# Altium schematic sheet main.SchDoc: Main
size A4; Date: 2014-12-21; Author: Artur Scholz; DocumentNumber: LibreCube LC23-01a
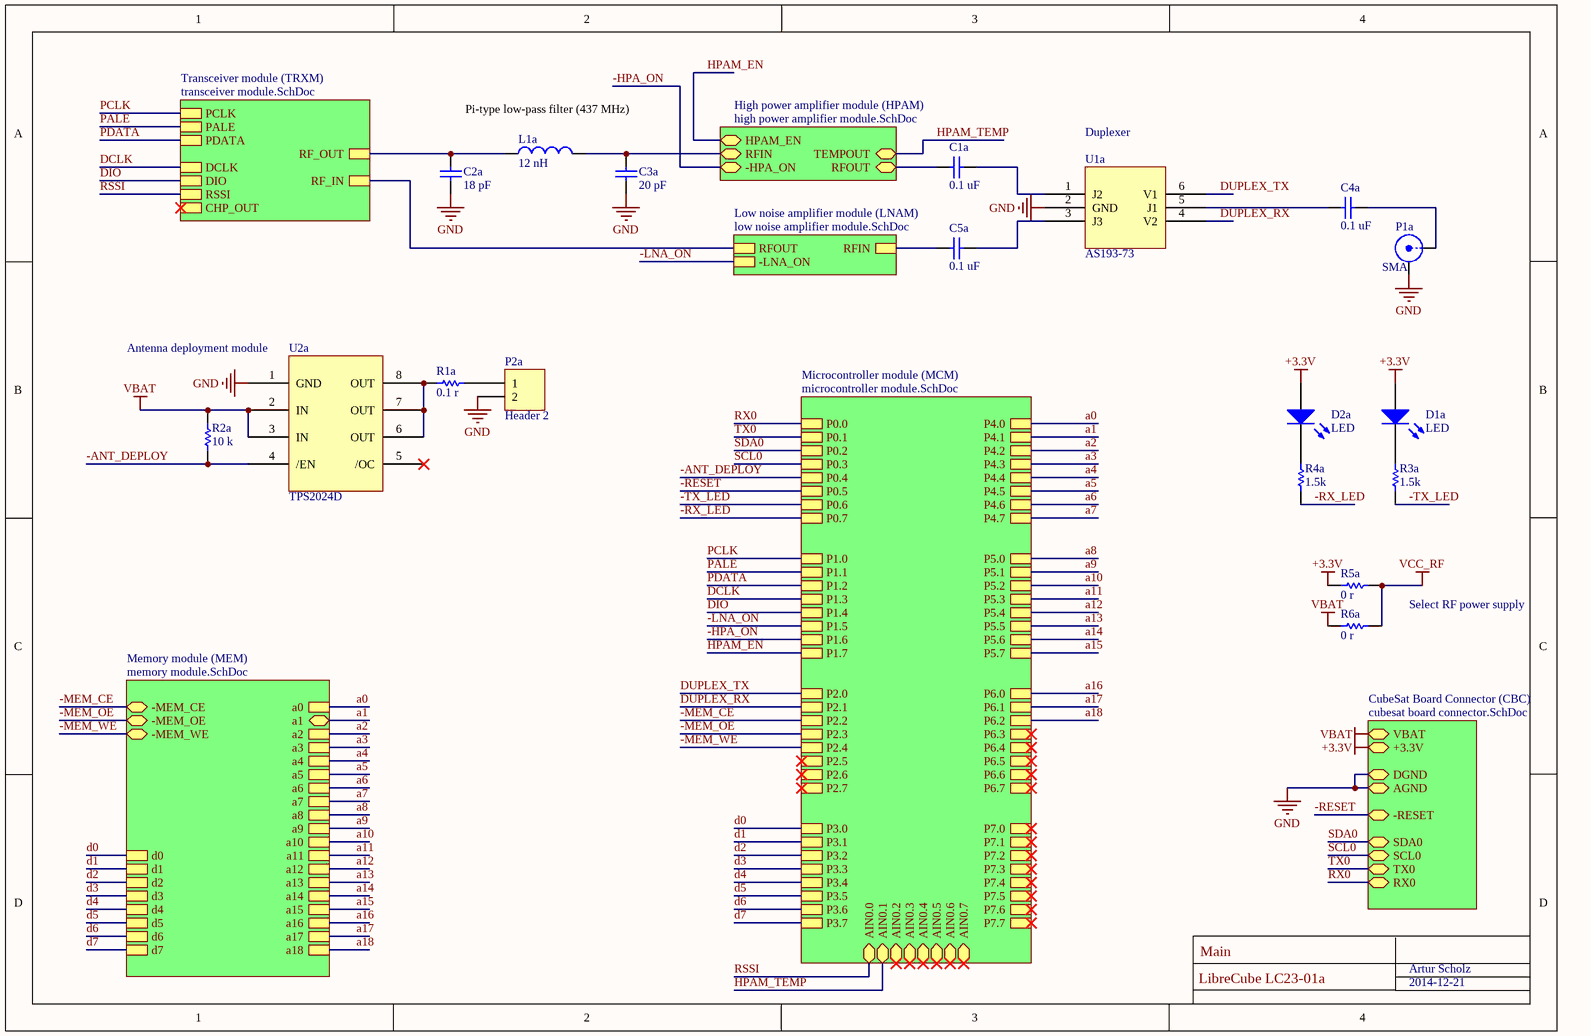
[diagram p0: main.SchDoc]

## Parts
C1a  0.1 uF  [0603]
C2a  18 pF  [0603]
C3a  20 pF  [0603]
C4a  0.1 uF  [0603]
C5a  0.1 uF  [0603]
D1a  LED  [0603]
D2a  LED  [0603]
L1a  12 nH  [0603]
P1a  SMA  [SMA]
P2a  Header 2  [HDR1X2]
R1a  0.1 r  [2512]
R2a  10 k  [0603]
R3a  1.5k  [0603]
R4a  1.5k  [0603]
R5a  0 r  [0603]
R6a  0 r  [0603]
U1a  AS193-73  [SOT-6]
U2a  TPS2024D  [SO-8]

## Sub-sheets
CubeSat Board Connector (CBC) = cubesat board connector.SchDoc: SDA0, SCL0, -RESET, +3.3V, VBAT, AGND, DGND, TX0, RX0
High power amplifier module (HPAM) = high power amplifier module.SchDoc: RFOUT, RFIN, HPAM_EN, TEMPOUT, -HPA_ON
Low noise amplifier module (LNAM) = low noise amplifier module.SchDoc: RFOUT, RFIN, -LNA_ON
Memory module (MEM) = memory module.SchDoc: a13, a11, a9, a8, a18, a17, a15, a7, a16, a14, a12, a6, a5, a4, a0, d0, a3, a2, d3, d1, d2, d7, d4, d5, d6, a10, a1, -MEM_WE, -MEM_CE, -MEM_OE
Microcontroller module (MCM) = microcontroller module.SchDoc: P0.0, P0.1, P0.2, P0.3, P0.4, P0.5, P0.6, P0.7, P3.0, P3.1, P3.2, P3.3, P3.4, P3.5, P3.6, P3.7, P2.0, P2.1, P2.2, P2.3, P2.4, P2.5, P2.6, P2.7, P1.0, P1.1, P1.2, P1.3, P1.4, P1.5, P1.6, P1.7, P4.0, P4.1, P4.2, P4.3, P4.4, P4.5, P4.6, P4.7, P7.0, P7.1, P7.2, P7.3, P7.4, P7.5, P7.6, P7.7, P5.0, P5.1, P5.2, P5.3, P5.4, P5.5, P5.6, P5.7, P6.0, P6.1, P6.2, P6.3, P6.4, P6.5, P6.6, P6.7, AIN0.0, AIN0.1, AIN0.2, AIN0.3, AIN0.4, AIN0.5, AIN0.6, AIN0.7
Transceiver module (TRXM) = transceiver module.SchDoc: PALE, PDATA, PCLK, DCLK, DIO, RSSI, CHP_OUT, RF_IN, RF_OUT

## Nets
+3.3V: D1a.1(A) D2a.1(A) R5a.2 ; sheet CubeSat Board Connector (CBC)/+3.3V
GND: C2a.1 C3a.1 P1a.2(Y) P2a.2 U1a.2(GND) U2a.1(GND) ; sheet CubeSat Board Connector (CBC)/AGND, sheet CubeSat Board Connector (CBC)/DGND
VBAT: R2a.2 R6a.2 U2a.2(IN) U2a.3(IN) ; sheet CubeSat Board Connector (CBC)/VBAT
VCC_RF: R5a.1 R6a.1
-ANT_DEPLOY: R2a.1 U2a.4(/EN) ; sheet Microcontroller module (MCM)/P0.4
-HPA_ON: sheet High power amplifier module (HPAM)/-HPA_ON, sheet Microcontroller module (MCM)/P1.6
-LNA_ON: sheet Microcontroller module (MCM)/P1.5, sheet Low noise amplifier module (LNAM)/-LNA_ON
-MEM_CE: sheet Memory module (MEM)/-MEM_CE, sheet Microcontroller module (MCM)/P2.2
-MEM_OE: sheet Memory module (MEM)/-MEM_OE, sheet Microcontroller module (MCM)/P2.3
-MEM_WE: sheet Memory module (MEM)/-MEM_WE, sheet Microcontroller module (MCM)/P2.4
-RESET: sheet CubeSat Board Connector (CBC)/-RESET, sheet Microcontroller module (MCM)/P0.5
-RX_LED: R4a.2 ; sheet Microcontroller module (MCM)/P0.7
-TX_LED: R3a.2 ; sheet Microcontroller module (MCM)/P0.6
a0: sheet Memory module (MEM)/a0, sheet Microcontroller module (MCM)/P4.0
a1: sheet Memory module (MEM)/a1, sheet Microcontroller module (MCM)/P4.1
a2: sheet Memory module (MEM)/a2, sheet Microcontroller module (MCM)/P4.2
a3: sheet Memory module (MEM)/a3, sheet Microcontroller module (MCM)/P4.3
a4: sheet Memory module (MEM)/a4, sheet Microcontroller module (MCM)/P4.4
a5: sheet Memory module (MEM)/a5, sheet Microcontroller module (MCM)/P4.5
a6: sheet Memory module (MEM)/a6, sheet Microcontroller module (MCM)/P4.6
a7: sheet Memory module (MEM)/a7, sheet Microcontroller module (MCM)/P4.7
a8: sheet Memory module (MEM)/a8, sheet Microcontroller module (MCM)/P5.0
a9: sheet Memory module (MEM)/a9, sheet Microcontroller module (MCM)/P5.1
a10: sheet Memory module (MEM)/a10, sheet Microcontroller module (MCM)/P5.2
a11: sheet Memory module (MEM)/a11, sheet Microcontroller module (MCM)/P5.3
a12: sheet Memory module (MEM)/a12, sheet Microcontroller module (MCM)/P5.4
a13: sheet Memory module (MEM)/a13, sheet Microcontroller module (MCM)/P5.5
a14: sheet Memory module (MEM)/a14, sheet Microcontroller module (MCM)/P5.6
a15: sheet Memory module (MEM)/a15, sheet Microcontroller module (MCM)/P5.7
a16: sheet Memory module (MEM)/a16, sheet Microcontroller module (MCM)/P6.0
a17: sheet Memory module (MEM)/a17, sheet Microcontroller module (MCM)/P6.1
a18: sheet Memory module (MEM)/a18, sheet Microcontroller module (MCM)/P6.2
d0: sheet Memory module (MEM)/d0, sheet Microcontroller module (MCM)/P3.0
d1: sheet Memory module (MEM)/d1, sheet Microcontroller module (MCM)/P3.1
d2: sheet Memory module (MEM)/d2, sheet Microcontroller module (MCM)/P3.2
d3: sheet Memory module (MEM)/d3, sheet Microcontroller module (MCM)/P3.3
d4: sheet Memory module (MEM)/d4, sheet Microcontroller module (MCM)/P3.4
d5: sheet Memory module (MEM)/d5, sheet Microcontroller module (MCM)/P3.5
d6: sheet Memory module (MEM)/d6, sheet Microcontroller module (MCM)/P3.6
d7: sheet Memory module (MEM)/d7, sheet Microcontroller module (MCM)/P3.7
DCLK: sheet Transceiver module (TRXM)/DCLK, sheet Microcontroller module (MCM)/P1.3
DIO: sheet Transceiver module (TRXM)/DIO, sheet Microcontroller module (MCM)/P1.4
DUPLEX_RX: U1a.4(V2) ; sheet Microcontroller module (MCM)/P2.1
DUPLEX_TX: U1a.6(V1) ; sheet Microcontroller module (MCM)/P2.0
HPAM_EN: sheet High power amplifier module (HPAM)/HPAM_EN, sheet Microcontroller module (MCM)/P1.7
HPAM_TEMP: sheet High power amplifier module (HPAM)/TEMPOUT, sheet Microcontroller module (MCM)/AIN0.1
PALE: sheet Transceiver module (TRXM)/PALE, sheet Microcontroller module (MCM)/P1.1
PCLK: sheet Transceiver module (TRXM)/PCLK, sheet Microcontroller module (MCM)/P1.0
PDATA: sheet Transceiver module (TRXM)/PDATA, sheet Microcontroller module (MCM)/P1.2
RSSI: sheet Transceiver module (TRXM)/RSSI, sheet Microcontroller module (MCM)/AIN0.0
RX0: sheet CubeSat Board Connector (CBC)/RX0, sheet Microcontroller module (MCM)/P0.0
SCL0: sheet CubeSat Board Connector (CBC)/SCL0, sheet Microcontroller module (MCM)/P0.3
SDA0: sheet CubeSat Board Connector (CBC)/SDA0, sheet Microcontroller module (MCM)/P0.2
TX0: sheet CubeSat Board Connector (CBC)/TX0, sheet Microcontroller module (MCM)/P0.1
NetC1a_1: C1a.1 ; sheet High power amplifier module (HPAM)/RFOUT
NetC1a_2: C1a.2 U1a.1(J2)
NetC2a_2: C2a.2 L1a.1 ; sheet Transceiver module (TRXM)/RF_OUT
NetC3a_2: C3a.2 L1a.2 ; sheet High power amplifier module (HPAM)/RFIN
NetC4a_1: C4a.1 P1a.1(X)
NetC4a_2: C4a.2 U1a.5(J1)
NetC5a_1: C5a.1 ; sheet Low noise amplifier module (LNAM)/RFIN
NetC5a_2: C5a.2 U1a.3(J3)
NetD1a_2: D1a.2(K) R3a.1
NetD2a_2: D2a.2(K) R4a.1
NetP2a_1: P2a.1 R1a.2
NetR1a_1: R1a.1 U2a.6(OUT) U2a.7(OUT) U2a.8(OUT)
(unnamed): sheet Transceiver module (TRXM)/RF_IN, sheet Low noise amplifier module (LNAM)/RFOUT

Not connected (* = marked no-connect by the designer): U2a 5(/OC)*

## Notes on the sheet
- Pi-type low-pass filter (437 MHz)
- Duplexer
- (near U2a) Antenna deployment module
- Select RF power supply

## Library data of the parts
C1a C2a C3a C4a C5a = Capacitor
D1a D2a = LED: Typical INFRARED GaAs LED
L1a = Inductor
P1a = SMA: SMA Connector; LatestRevisionDate: 17-Jul-2002; LatestRevisionNote: Re-released for DXP Platform.; Publisher: Altium Limited
P2a = Header 2: Header, 2-Pin; LatestRevisionDate: 17-Jul-2002; LatestRevisionNote: Re-released for DXP Platform.; Publisher: Altium Limited
R1a R3a R4a R5a R6a = Resistor
R2a = Res1: Value: 10K; Published: 8-Jun-2000; LatestRevisionDate: 17-Jul-2002; LatestRevisionNote: Re-released for DXP Platform.; PackageReference: AXIAL-0.3; Publisher: Altium Limited
U1a = AS193-73: RF SPDT Switch
U2a = TPS2024: 296-2564-5-ND